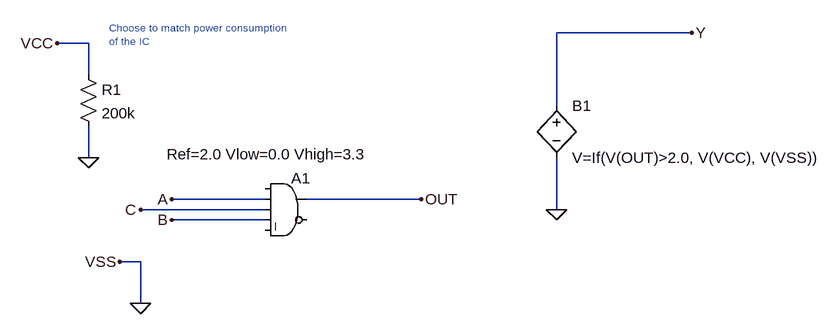
[diagram p0: schematic SN74LVC1G11.asc]
SN74LVC1G11.asc, the LTspice schematic file:
Version 4
SHEET 1 1040 680
WIRE 816 -112 608 -112
WIRE -112 -96 -160 -96
WIRE -112 -48 -112 -96
WIRE 608 0 608 -112
WIRE -112 80 -112 32
WIRE 160 144 16 144
WIRE 400 144 224 144
WIRE 160 160 -32 160
WIRE 608 160 608 80
WIRE 160 176 16 176
WIRE -32 240 -64 240
WIRE -32 304 -32 240
FLAG 16 144 A
FLAG 16 176 B
FLAG -64 240 VSS
FLAG -32 304 0
FLAG 400 144 OUT
FLAG -160 -96 VCC
FLAG -32 160 C
FLAG -112 80 0
FLAG 608 160 0
FLAG 816 -112 Y
SYMBOL Digital\\and 192 96 R0
WINDOW 39 -184 -21 Left 2
SYMATTR InstName A1
SYMATTR SpiceLine Ref=2.0 Vlow=0.0 Vhigh=3.3
SYMBOL res -128 -64 R0
SYMATTR InstName R1
SYMATTR Value 200k
SYMBOL bv 608 -16 R0
SYMATTR InstName B1
SYMATTR Value V=If(V(OUT)>2.0, V(VCC), V(VSS))
TEXT -80 -120 Left 1 ;Choose to match power consumption\nof the IC

The netlist it stands for:
* SN74LVC1G11.asc
A1 0 A C B 0 0 OUT 0 AND Ref=2.0 Vlow=0.0 Vhigh=3.3
R1 VCC 0 200k
B1 Y 0 V=If(V(OUT)>2.0, V(VCC), V(VSS))
* Choose to match power consumption
* of the IC
.backanno
.end